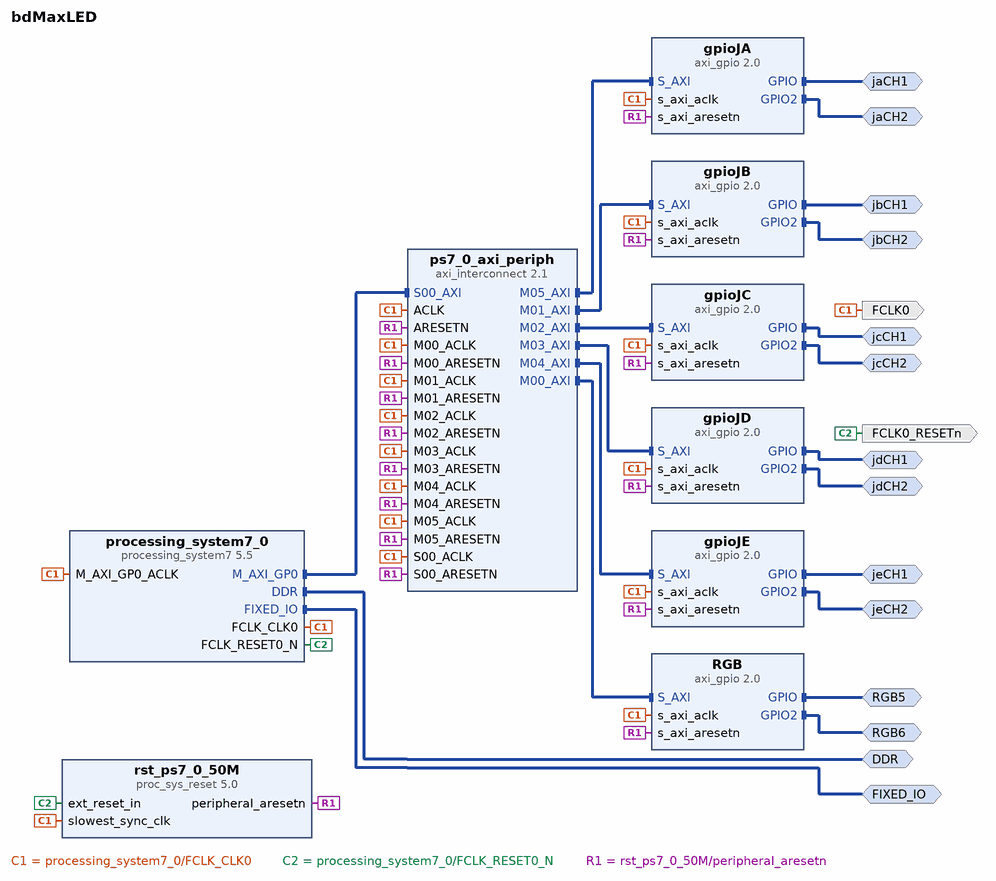
[diagram p0: block diagram of the top level]
# Vivado block design bdMaxLED, xc7z020clg400-1, Vivado 2023.2
create_bd_design bdMaxLED

create_bd_intf_port -mode Master -vlnv xilinx.com:interface:ddrx_rtl:1.0 DDR
create_bd_intf_port -mode Master -vlnv xilinx.com:display_processing_system7:fixedio_rtl:1.0 FIXED_IO
create_bd_intf_port -mode Master -vlnv xilinx.com:interface:gpio_rtl:1.0 RGB5
create_bd_intf_port -mode Master -vlnv xilinx.com:interface:gpio_rtl:1.0 RGB6
create_bd_intf_port -mode Master -vlnv xilinx.com:interface:gpio_rtl:1.0 jbCH1
create_bd_intf_port -mode Master -vlnv xilinx.com:interface:gpio_rtl:1.0 jbCH2
create_bd_intf_port -mode Master -vlnv xilinx.com:interface:gpio_rtl:1.0 jcCH1
create_bd_intf_port -mode Master -vlnv xilinx.com:interface:gpio_rtl:1.0 jcCH2
create_bd_intf_port -mode Master -vlnv xilinx.com:interface:gpio_rtl:1.0 jdCH1
create_bd_intf_port -mode Master -vlnv xilinx.com:interface:gpio_rtl:1.0 jeCH1
create_bd_intf_port -mode Master -vlnv xilinx.com:interface:gpio_rtl:1.0 jeCH2
create_bd_intf_port -mode Master -vlnv xilinx.com:interface:gpio_rtl:1.0 jdCH2
create_bd_intf_port -mode Master -vlnv xilinx.com:interface:gpio_rtl:1.0 jaCH1
create_bd_intf_port -mode Master -vlnv xilinx.com:interface:gpio_rtl:1.0 jaCH2
create_bd_port -dir O -type clk FCLK0
create_bd_port -dir O -type rst FCLK0_RESETn

create_bd_cell -type ip -vlnv xilinx.com:ip:processing_system7:5.5 processing_system7_0
set_property -dict [list \
  CONFIG.PCW_APU_PERIPHERAL_FREQMHZ 667 \
  CONFIG.PCW_ENET0_ENET0_IO {MIO 16 .. 27} \
  CONFIG.PCW_ENET0_GRP_MDIO_ENABLE 1 \
  CONFIG.PCW_ENET0_GRP_MDIO_IO {MIO 52 .. 53} \
  CONFIG.PCW_ENET0_PERIPHERAL_ENABLE 1 \
  CONFIG.PCW_ENET0_RESET_ENABLE 0 \
  CONFIG.PCW_ENET_RESET_ENABLE 1 \
  CONFIG.PCW_ENET_RESET_SELECT {Share reset pin} \
  CONFIG.PCW_FPGA0_PERIPHERAL_FREQMHZ 125 \
  CONFIG.PCW_GPIO_MIO_GPIO_ENABLE 1 \
  CONFIG.PCW_GPIO_MIO_GPIO_IO MIO \
  CONFIG.PCW_I2C_RESET_ENABLE 1 \
  CONFIG.PCW_PRESET_BANK1_VOLTAGE {LVCMOS 1.8V} \
  CONFIG.PCW_QSPI_GRP_FBCLK_ENABLE 1 \
  CONFIG.PCW_QSPI_GRP_FBCLK_IO {MIO 8} \
  CONFIG.PCW_QSPI_GRP_SINGLE_SS_ENABLE 1 \
  CONFIG.PCW_QSPI_GRP_SINGLE_SS_IO {MIO 1 .. 6} \
  CONFIG.PCW_QSPI_PERIPHERAL_ENABLE 1 \
  CONFIG.PCW_QSPI_QSPI_IO {MIO 1 .. 6} \
  CONFIG.PCW_SD0_GRP_CD_ENABLE 1 \
  CONFIG.PCW_SD0_GRP_CD_IO {MIO 47} \
  CONFIG.PCW_SD0_GRP_WP_ENABLE 0 \
  CONFIG.PCW_SD0_PERIPHERAL_ENABLE 1 \
  CONFIG.PCW_SD0_SD0_IO {MIO 40 .. 45} \
  CONFIG.PCW_SDIO_PERIPHERAL_FREQMHZ 50 \
  CONFIG.PCW_SINGLE_QSPI_DATA_MODE x4 \
  CONFIG.PCW_UART1_PERIPHERAL_ENABLE 1 \
  CONFIG.PCW_UART1_UART1_IO {MIO 48 .. 49} \
  CONFIG.PCW_UART_PERIPHERAL_FREQMHZ 100 \
  CONFIG.PCW_UIPARAM_DDR_FREQ_MHZ 533.333333 \
  CONFIG.PCW_UIPARAM_DDR_MEMORY_TYPE {DDR 3 (Low Voltage)} \
  CONFIG.PCW_UIPARAM_DDR_PARTNO {MT41K256M16 RE-125} \
  CONFIG.PCW_USB0_PERIPHERAL_ENABLE 1 \
  CONFIG.PCW_USB0_RESET_ENABLE 1 \
  CONFIG.PCW_USB0_RESET_IO {MIO 46} \
  CONFIG.PCW_USB0_USB0_IO {MIO 28 .. 39} \
  CONFIG.PCW_USB_RESET_ENABLE 1 \
  CONFIG.PCW_USB_RESET_SELECT {Share reset pin} \
] [get_bd_cells processing_system7_0]
# 296 more settings of processing_system7_0 are not shown: defaults, MIO pin electricals, DDR timing, and values the tool derives
create_bd_cell -type ip -vlnv xilinx.com:ip:axi_gpio:2.0 RGB
set_property -dict {CONFIG.C_ALL_OUTPUTS 1 CONFIG.C_ALL_OUTPUTS_2 1 CONFIG.C_IS_DUAL 1} [get_bd_cells RGB]
create_bd_cell -type ip -vlnv xilinx.com:ip:axi_interconnect:2.1 ps7_0_axi_periph
set_property -dict {CONFIG.NUM_MI 6} [get_bd_cells ps7_0_axi_periph]
create_bd_cell -type ip -vlnv xilinx.com:ip:proc_sys_reset:5.0 rst_ps7_0_50M
create_bd_cell -type ip -vlnv xilinx.com:ip:axi_gpio:2.0 gpioJB
set_property -dict [list \
  CONFIG.C_ALL_INPUTS_2 0 \
  CONFIG.C_ALL_OUTPUTS 1 \
  CONFIG.C_ALL_OUTPUTS_2 1 \
  CONFIG.C_GPIO2_WIDTH 32 \
  CONFIG.C_INTERRUPT_PRESENT 0 \
  CONFIG.C_IS_DUAL 1 \
] [get_bd_cells gpioJB]
create_bd_cell -type ip -vlnv xilinx.com:ip:axi_gpio:2.0 gpioJC
set_property -dict {CONFIG.C_ALL_OUTPUTS 1 CONFIG.C_ALL_OUTPUTS_2 1 CONFIG.C_IS_DUAL 1} [get_bd_cells gpioJC]
create_bd_cell -type ip -vlnv xilinx.com:ip:axi_gpio:2.0 gpioJD
set_property -dict {CONFIG.C_ALL_OUTPUTS 1 CONFIG.C_ALL_OUTPUTS_2 1 CONFIG.C_IS_DUAL 1} [get_bd_cells gpioJD]
create_bd_cell -type ip -vlnv xilinx.com:ip:axi_gpio:2.0 gpioJE
set_property -dict {CONFIG.C_ALL_OUTPUTS 1 CONFIG.C_ALL_OUTPUTS_2 1 CONFIG.C_IS_DUAL 1} [get_bd_cells gpioJE]
create_bd_cell -type ip -vlnv xilinx.com:ip:axi_gpio:2.0 gpioJA
set_property -dict {CONFIG.C_ALL_OUTPUTS 1 CONFIG.C_ALL_OUTPUTS_2 1 CONFIG.C_IS_DUAL 1} [get_bd_cells gpioJA]

# ---- connections ----

connect_bd_intf_net -intf_net JE_GPIO [get_bd_intf_ports jbCH1] [get_bd_intf_pins gpioJB/GPIO]
connect_bd_intf_net -intf_net axi_gpio_0_GPIO [get_bd_intf_ports RGB5] [get_bd_intf_pins RGB/GPIO]
connect_bd_intf_net -intf_net axi_gpio_0_GPIO1 [get_bd_intf_ports jeCH1] [get_bd_intf_pins gpioJE/GPIO]
connect_bd_intf_net -intf_net axi_gpio_0_GPIO2 [get_bd_intf_ports RGB6] [get_bd_intf_pins RGB/GPIO2]
connect_bd_intf_net -intf_net axi_gpio_0_GPIO3 [get_bd_intf_ports jeCH2] [get_bd_intf_pins gpioJE/GPIO2]
connect_bd_intf_net [get_bd_intf_ports jaCH1] [get_bd_intf_pins gpioJA/GPIO]
connect_bd_intf_net [get_bd_intf_ports jaCH2] [get_bd_intf_pins gpioJA/GPIO2]
connect_bd_intf_net [get_bd_intf_ports jbCH2] [get_bd_intf_pins gpioJB/GPIO2]
connect_bd_intf_net [get_bd_intf_ports jcCH1] [get_bd_intf_pins gpioJC/GPIO]
connect_bd_intf_net [get_bd_intf_ports jcCH2] [get_bd_intf_pins gpioJC/GPIO2]
connect_bd_intf_net [get_bd_intf_ports jdCH1] [get_bd_intf_pins gpioJD/GPIO]
connect_bd_intf_net [get_bd_intf_ports jdCH2] [get_bd_intf_pins gpioJD/GPIO2]
connect_bd_intf_net [get_bd_intf_ports DDR] [get_bd_intf_pins processing_system7_0/DDR]
connect_bd_intf_net [get_bd_intf_ports FIXED_IO] [get_bd_intf_pins processing_system7_0/FIXED_IO]
connect_bd_intf_net [get_bd_intf_pins processing_system7_0/M_AXI_GP0] [get_bd_intf_pins ps7_0_axi_periph/S00_AXI]
connect_bd_intf_net [get_bd_intf_pins ps7_0_axi_periph/M00_AXI] [get_bd_intf_pins RGB/S_AXI]
connect_bd_intf_net [get_bd_intf_pins ps7_0_axi_periph/M01_AXI] [get_bd_intf_pins gpioJB/S_AXI]
connect_bd_intf_net [get_bd_intf_pins ps7_0_axi_periph/M02_AXI] [get_bd_intf_pins gpioJC/S_AXI]
connect_bd_intf_net [get_bd_intf_pins ps7_0_axi_periph/M03_AXI] [get_bd_intf_pins gpioJD/S_AXI]
connect_bd_intf_net [get_bd_intf_pins ps7_0_axi_periph/M04_AXI] [get_bd_intf_pins gpioJE/S_AXI]
connect_bd_intf_net [get_bd_intf_pins ps7_0_axi_periph/M05_AXI] [get_bd_intf_pins gpioJA/S_AXI]
connect_bd_net [get_bd_pins processing_system7_0/FCLK_CLK0] \
  [get_bd_pins processing_system7_0/M_AXI_GP0_ACLK] [get_bd_ports FCLK0] [get_bd_pins ps7_0_axi_periph/S00_ACLK] \
  [get_bd_pins rst_ps7_0_50M/slowest_sync_clk] [get_bd_pins RGB/s_axi_aclk] [get_bd_pins ps7_0_axi_periph/M00_ACLK] \
  [get_bd_pins ps7_0_axi_periph/ACLK] [get_bd_pins gpioJB/s_axi_aclk] [get_bd_pins ps7_0_axi_periph/M01_ACLK] \
  [get_bd_pins gpioJC/s_axi_aclk] [get_bd_pins ps7_0_axi_periph/M02_ACLK] [get_bd_pins gpioJD/s_axi_aclk] \
  [get_bd_pins ps7_0_axi_periph/M03_ACLK] [get_bd_pins gpioJE/s_axi_aclk] [get_bd_pins ps7_0_axi_periph/M04_ACLK] \
  [get_bd_pins gpioJA/s_axi_aclk] [get_bd_pins ps7_0_axi_periph/M05_ACLK]
connect_bd_net [get_bd_pins processing_system7_0/FCLK_RESET0_N] [get_bd_pins rst_ps7_0_50M/ext_reset_in] [get_bd_ports FCLK0_RESETn]
connect_bd_net [get_bd_pins rst_ps7_0_50M/peripheral_aresetn] \
  [get_bd_pins ps7_0_axi_periph/S00_ARESETN] [get_bd_pins RGB/s_axi_aresetn] [get_bd_pins ps7_0_axi_periph/M00_ARESETN] \
  [get_bd_pins ps7_0_axi_periph/ARESETN] [get_bd_pins gpioJB/s_axi_aresetn] [get_bd_pins ps7_0_axi_periph/M01_ARESETN] \
  [get_bd_pins gpioJC/s_axi_aresetn] [get_bd_pins ps7_0_axi_periph/M02_ARESETN] [get_bd_pins gpioJD/s_axi_aresetn] \
  [get_bd_pins ps7_0_axi_periph/M03_ARESETN] [get_bd_pins gpioJE/s_axi_aresetn] [get_bd_pins ps7_0_axi_periph/M04_ARESETN] \
  [get_bd_pins gpioJA/s_axi_aresetn] [get_bd_pins ps7_0_axi_periph/M05_ARESETN]

# ---- address map ----
assign_bd_address -offset 0x41200000 -range 64K -target_address_space [get_bd_addr_spaces processing_system7_0/Data] [get_bd_addr_segs RGB/S_AXI/Reg]
assign_bd_address -offset 0x41210000 -range 64K -target_address_space [get_bd_addr_spaces processing_system7_0/Data] [get_bd_addr_segs gpioJB/S_AXI/Reg]
assign_bd_address -offset 0x41220000 -range 64K -target_address_space [get_bd_addr_spaces processing_system7_0/Data] [get_bd_addr_segs gpioJC/S_AXI/Reg]
assign_bd_address -offset 0x41230000 -range 64K -target_address_space [get_bd_addr_spaces processing_system7_0/Data] [get_bd_addr_segs gpioJD/S_AXI/Reg]
assign_bd_address -offset 0x41240000 -range 64K -target_address_space [get_bd_addr_spaces processing_system7_0/Data] [get_bd_addr_segs gpioJE/S_AXI/Reg]
assign_bd_address -offset 0x41250000 -range 64K -target_address_space [get_bd_addr_spaces processing_system7_0/Data] [get_bd_addr_segs gpioJA/S_AXI/Reg]

validate_bd_design
save_bd_design
